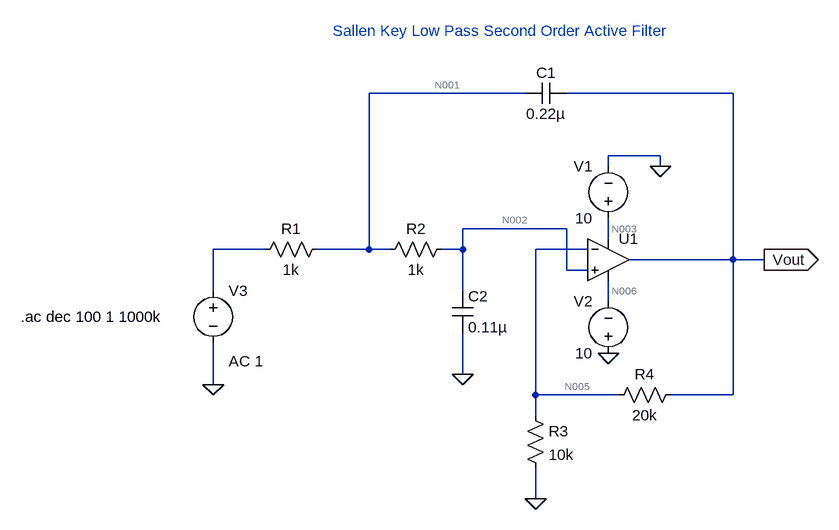
[diagram p0: schematic Second Order Low Pass Active Filter.asc]
Second Order Low Pass Active Filter.asc, the LTspice schematic file:
Version 4
SHEET 1 880 680
WIRE 144 -96 -96 -96
WIRE 464 -96 208 -96
WIRE 352 0 272 0
WIRE 272 16 272 0
WIRE 352 16 352 0
WIRE 208 112 48 112
WIRE 272 128 272 96
WIRE -256 144 -336 144
WIRE -96 144 -96 -96
WIRE -96 144 -176 144
WIRE -64 144 -96 144
WIRE 48 144 48 112
WIRE 48 144 16 144
WIRE 240 144 160 144
WIRE 464 160 464 -96
WIRE 464 160 304 160
WIRE 512 160 464 160
WIRE 208 176 208 112
WIRE 240 176 208 176
WIRE -336 208 -336 144
WIRE 48 208 48 144
WIRE 272 224 272 192
WIRE 48 336 48 272
WIRE -336 352 -336 288
WIRE 160 368 160 144
WIRE 288 368 160 368
WIRE 464 368 464 160
WIRE 464 368 368 368
WIRE 160 400 160 368
WIRE 160 528 160 480
FLAG 272 304 0
FLAG -336 352 0
FLAG 48 336 0
FLAG 160 528 0
FLAG 352 16 0
FLAG 512 160 Vout
IOPIN 512 160 Out
SYMBOL Opamps\\UniversalOpamp2 272 160 R0
SYMATTR InstName U1
SYMBOL res -160 128 R90
WINDOW 0 0 56 VBottom 2
WINDOW 3 32 56 VTop 2
SYMATTR InstName R1
SYMATTR Value 1k
SYMBOL res 32 128 R90
WINDOW 0 0 56 VBottom 2
WINDOW 3 32 56 VTop 2
SYMATTR InstName R2
SYMATTR Value 1k
SYMBOL res 144 384 R0
SYMATTR InstName R3
SYMATTR Value 10k
SYMBOL res 384 352 R90
WINDOW 0 0 56 VBottom 2
WINDOW 3 32 56 VTop 2
SYMATTR InstName R4
SYMATTR Value 20k
SYMBOL voltage 272 112 R180
WINDOW 0 24 96 Left 2
WINDOW 3 24 16 Left 2
WINDOW 123 0 0 Left 0
WINDOW 39 0 0 Left 0
SYMATTR InstName V1
SYMATTR Value 10
SYMBOL voltage 272 320 R180
WINDOW 0 24 96 Left 2
WINDOW 3 24 16 Left 2
WINDOW 123 0 0 Left 0
WINDOW 39 0 0 Left 0
SYMATTR InstName V2
SYMATTR Value 10
SYMBOL cap 208 -112 R90
WINDOW 0 0 32 VBottom 2
WINDOW 3 32 32 VTop 2
SYMATTR InstName C1
SYMATTR Value 0.22µ
SYMBOL cap 32 208 R0
SYMATTR InstName C2
SYMATTR Value 0.11µ
SYMBOL voltage -336 192 R0
WINDOW 123 24 124 Left 2
WINDOW 39 0 0 Left 0
SYMATTR Value2 AC 1
SYMATTR InstName V3
SYMATTR Value ""
TEXT -152 -192 Left 2 ;Sallen Key Low Pass Second Order Active Filter
TEXT -632 248 Left 2 !.ac dec 100 1 1000k

The netlist it stands for:
* Second Order Low Pass Active Filter.asc
XU1 N002 N005 N003 N006 Vout level.2 Avol=1Meg GBW=10Meg Slew=10Meg ilimit=25m rail=0 Vos=0 phimargin=45 en=0 enk=0 in=0 ink=0 Rin=500Meg  ; pins IN+ IN- V+ V- OUT
R1 N001 N004 1k
R2 N002 N001 1k
R3 N005 0 10k
R4 Vout N005 20k
V1 N003 0 10
V2 0 N006 10
C1 Vout N001 0.22µ
C2 N002 0 0.11µ
V3 N004 0 AC 1
* Sallen Key Low Pass Second Order Active Filter
.ac dec 100 1 1000k
.lib UniversalOpamps2.sub
.backanno
.end

* Results of the author's LTspice run, read from the files saved beside the schematic
* Operating Point, zero values left out:
*   V(n003) = 10 V
*   V(n006) = -10 V
*   I(V2) = -999.5 µA
*   I(V1) = -999.5 µA
*   Ix(u1:3) = 999.5 µA
*   Ix(u1:4) = -999.5 µA
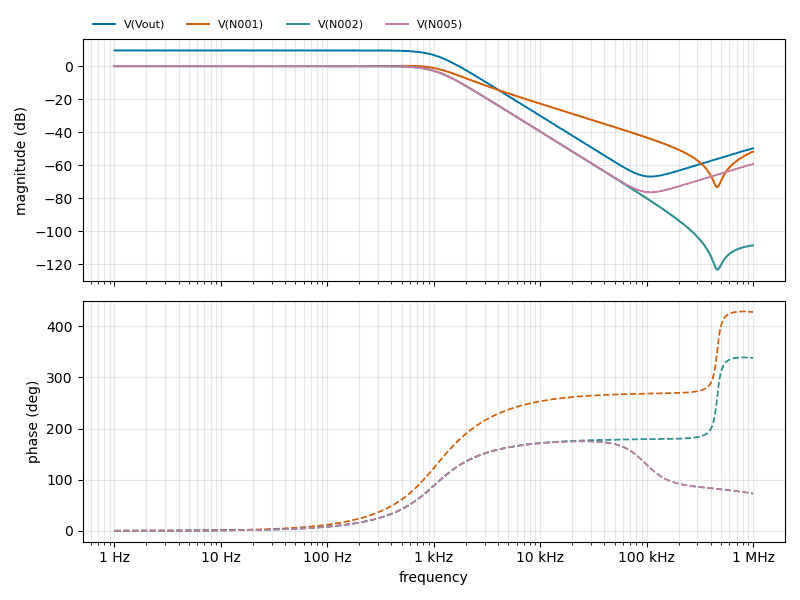
[diagram p1: AC Analysis of Second Order Low Pass Active Filter.asc, plotted from the saved traces]
* AC Analysis, 1 run:
*   V(Vout): 9.54 dB at 1 Hz, -49.73 dB at 1 MHz, peak 9.54 dB at 36.31 Hz, 3 dB below the peak at 1.023 kHz
*   V(N001): -0.00 dB at 1 Hz, -51.77 dB at 1 MHz, peak 0.25 dB at 501.2 Hz, 3 dB below the peak at 1.263 kHz
*   V(N002): -0.00 dB at 1 Hz, -108.56 dB at 1 MHz, peak -0.00 dB at 36.31 Hz, 3 dB below the peak at 1.023 kHz
*   V(N005): -0.00 dB at 1 Hz, -59.27 dB at 1 MHz, peak -0.00 dB at 36.31 Hz, 3 dB below the peak at 1.023 kHz